# Altium project spectral_clock.PrjPcb
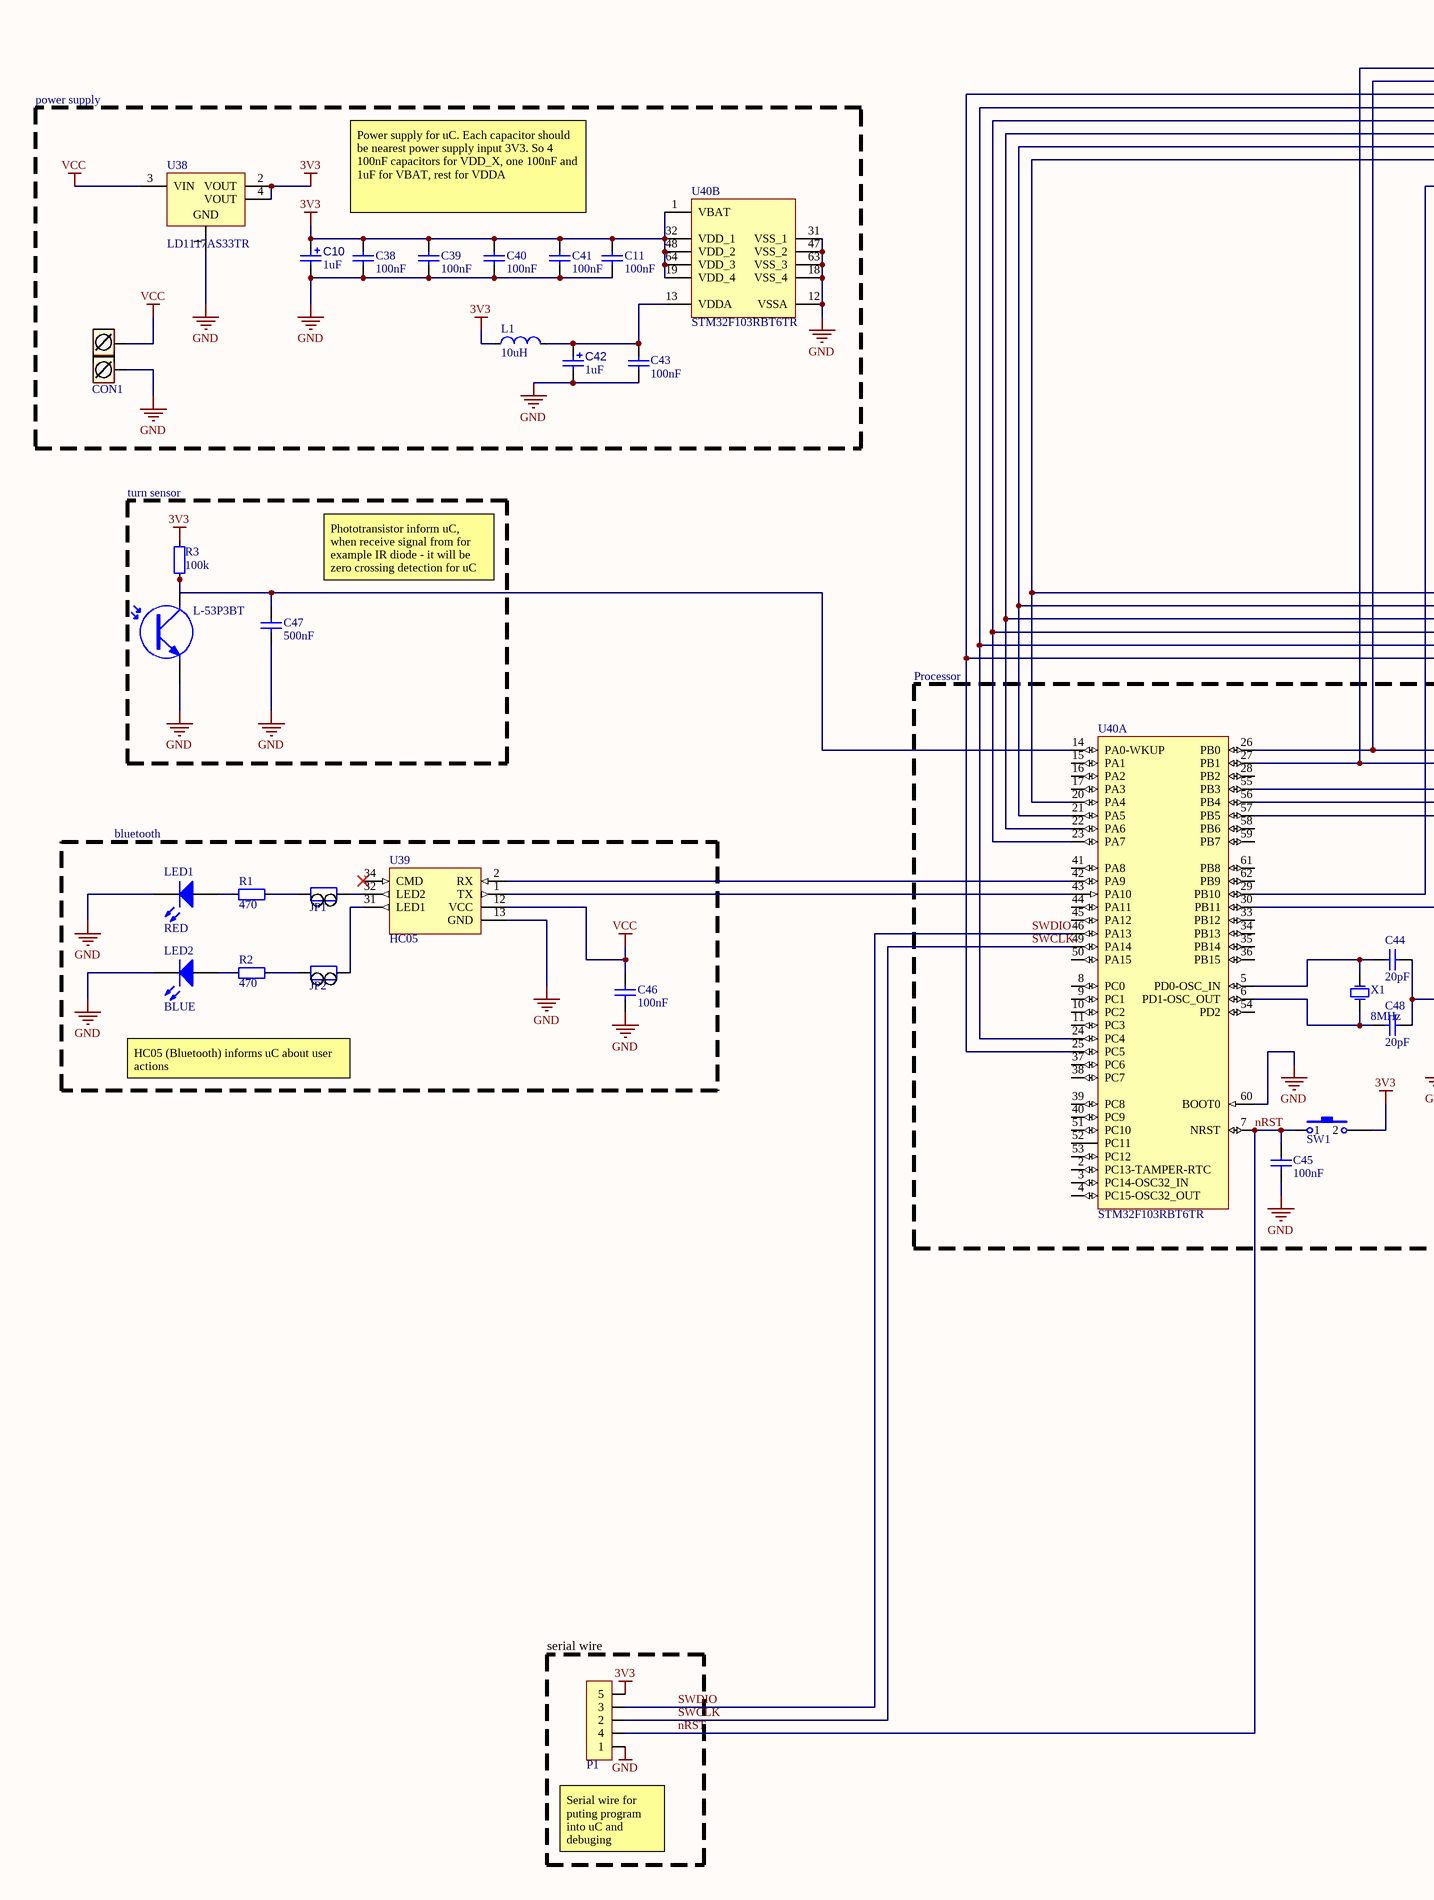
[diagram p0: spectral_clock.SchDoc, left]
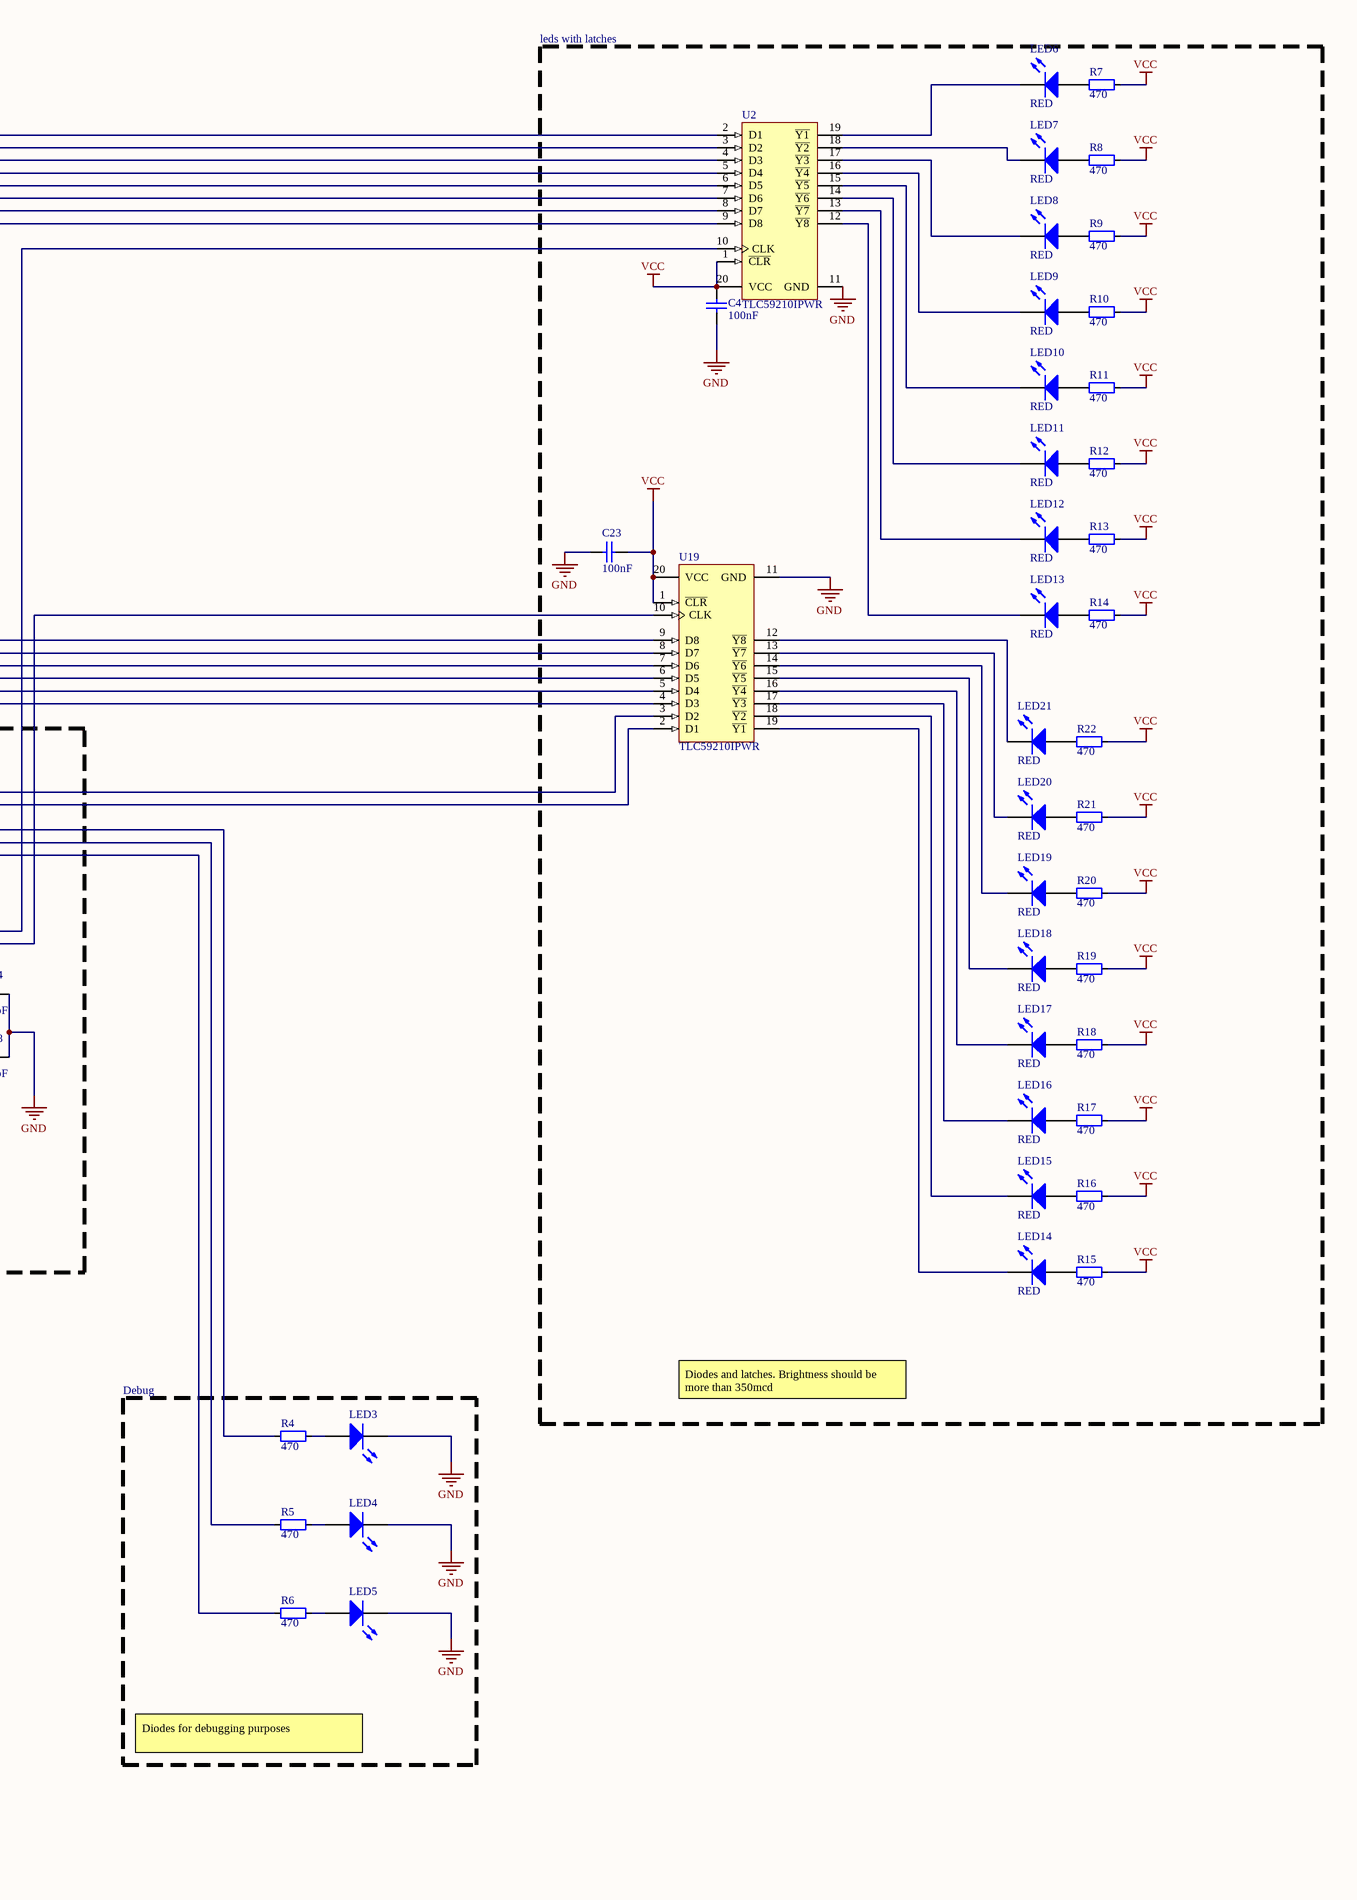
[diagram p1: spectral_clock.SchDoc, right]
1 sheet, 71 parts. Net scope: global (net labels, ports and power ports of the same name join across sheets).
Board file: spectral_clock.PcbDoc

## Sheet spectral_clock.SchDoc: Spectral clock schematic
size A2; DrawnBy: Jakub Wieczorek; DocumentNumber: 1; Revision: V2; SheetNumber: 1; SheetTotal: 1; url: https://github.com/jakubwieczorek/spectral_clock

### Parts
C4  value 100nF  [0603_CAP]  (hidden comment: Cap)
C10  1uF  [Con_SMD_4x5]
C11  value 100nF  [0603_CAP]  (hidden comment: Cap)
C23  value 100nF  [0603_CAP]  (hidden comment: Cap)
C38  value 100nF  [0603_CAP]  (hidden comment: Cap)
C39  value 100nF  [0603_CAP]  (hidden comment: Cap)
C40  value 100nF  [0603_CAP]  (hidden comment: Cap)
C41  value 100nF  [0603_CAP]  (hidden comment: Cap)
C42  1uF  [Con_SMD_4x5]
C43  value 100nF  [0603_CAP]  (hidden comment: Cap)
C44  value 20pF  [0603_CAP]  (hidden comment: Cap)
C45  value 100nF  [0603_CAP]  (hidden comment: Cap)
C46  value 100nF  [0603_CAP]  (hidden comment: Cap)
C47  value 500nF  [0603_CAP]  (hidden comment: Cap)
C48  value 20pF  [0603_CAP]  (hidden comment: Cap)
CON1  ARK2  [ARK2]  (value not drawn)
JP1  Jumper  [HDR1X2 - JP]  (value not drawn)
JP2  Jumper  [HDR1X2 - JP]  (value not drawn)
L1  10uH  [0603_IND]
L-53P3BT  Phototransistor  [LED_THT]  (value not drawn)
LED1  RED  [0603_led_red]
LED2  BLUE  [0603_led_blue]
LED3  (no value)  [0603_led_green]
LED4  RED  [0603_led_green]  (value not drawn)
LED5  RED  [0603_led_green]  (value not drawn)
LED6  RED  [0603_led_blue]
LED7  RED  [0603_led_blue]
LED8  RED  [0603_led_blue]
LED9  RED  [0603_led_blue]
LED10  RED  [0603_led_blue]
LED11  RED  [0603_led_blue]
LED12  RED  [0603_led_blue]
LED13  RED  [0603_led_blue]
LED14  RED  [0603_led_blue]
LED15  RED  [0603_led_blue]
LED16  RED  [0603_led_blue]
LED17  RED  [0603_led_blue]
LED18  RED  [0603_led_blue]
LED19  RED  [0603_led_blue]
LED20  RED  [0603_led_blue]
LED21  RED  [0603_led_blue]
P1  HDR1X5  [HDR1X5]  (value not drawn)
R1  470  [0603_RES]
R2  470  [0603_RES]
R3  100k  [0603_RES]
R4  470  [0603_RES]
R5  470  [0603_RES]
R6  470  [0603_RES]
R7  470  [0603_RES]
R8  470  [0603_RES]
R9  470  [0603_RES]
R10  470  [0603_RES]
R11  470  [0603_RES]
R12  470  [0603_RES]
R13  470  [0603_RES]
R14  470  [0603_RES]
R15  470  [0603_RES]
R16  470  [0603_RES]
R17  470  [0603_RES]
R18  470  [0603_RES]
R19  470  [0603_RES]
R20  470  [0603_RES]
R21  470  [0603_RES]
R22  470  [0603_RES]
SW1  Micro_Switch  [Tact 34N-F]  (value not drawn)
U2  TLC59210IPWR  [PW0020A_M]
U19  TLC59210IPWR  [PW0020A_M]
U38  LD1117AS33TR  [SOT-223_M]
U39  HC05  [HC05]
U40  STM32F103RBT6TR  [STM-LQFP64_V]  (parts A,B of 2)
X1  value 8MHz  [HC49/4H_SMX]

### Blocks framed on the sheet
leds with latches: C4 C23 LED6-LED21 R7-R22 U2 U19
power supply: C10 C11 C38-C43 CON1 L1 U38 U40
turn sensor: C47 L-53P3BT R3
Processor: C44 C45 C48 SW1 U40 X1
bluetooth: C46 JP1 JP2 LED1 LED2 R1 R2 U39
Debug: LED3-LED5 R4-R6
serial wire: P1

### Nets
3V3: C10.1 C11.2 C38.2 C39.2 C40.2 C41.2 L1.1 P1.5 R3.2 SW1.2 U38.2(VOUT) U38.4(VOUT) U40.1(VBAT) U40.19(VDD_4) U40.32(VDD_1) U40.48(VDD_2) U40.64(VDD_3)
GND: C4.2 C10.2 C11.1 C23.2 C38.1 C39.1 C40.1 C41.1 C42.2 C43.1 C44.2 C45.1 C46.2 C47.1 C48.2 CON1.1 L-53P3BT.1(E) LED1.2(K) LED2.2(K) LED3.2(K) LED4.2(K) LED5.2(K) P1.1 U2.11(GND) U19.11(GND) U38.1(GND) U39.13(GND) U40.12(VSSA) U40.18(VSS_4) U40.31(VSS_1) U40.47(VSS_2) U40.60(BOOT0) U40.63(VSS_3)
VCC: C4.1 C23.1 C46.1 CON1.2 R7.2 R8.2 R9.2 R10.2 R11.2 R12.2 R13.2 R14.2 R15.2 R16.2 R17.2 R18.2 R19.2 R20.2 R21.2 R22.2 U2.1(~{CLR}) U2.20(VCC) U19.1(~{CLR}) U19.20(VCC) U38.3(VIN) U39.12(VCC)
nRST: C45.2 P1.4 SW1.1 U40.7(NRST)
SWCLK: P1.2 U40.49(PA14)
SWDIO: P1.3 U40.46(PA13)
NetC42_1: C42.1 C43.2 L1.2 U40.13(VDDA)
NetC44_1: C44.1 U40.5(PD0-OSC_IN) X1.1(OSC1)
NetC47_2: C47.2 L-53P3BT.2(C) R3.1 U40.14(PA0-WKUP)
NetC48_1: C48.1 U40.6(PD1-OSC_OUT) X1.2(OSC2)
NetJP1_1: JP1.1 U39.32(LED2)
NetJP1_2: JP1.2 R1.1
NetJP2_1: JP2.1 U39.31(LED1)
NetJP2_2: JP2.2 R2.1
NetLED1_1: LED1.1(A) R1.2
NetLED2_1: LED2.1(A) R2.2
NetLED3_1: LED3.1(A) R4.2
NetLED4_1: LED4.1(A) R5.2
NetLED5_1: LED5.1(A) R6.2
NetLED6_1: LED6.1(A) R7.1
NetLED6_2: LED6.2(K) U2.19(~{Y1})
NetLED7_1: LED7.1(A) R8.1
NetLED7_2: LED7.2(K) U2.18(~{Y2})
NetLED8_1: LED8.1(A) R9.1
NetLED8_2: LED8.2(K) U2.17(~{Y3})
NetLED9_1: LED9.1(A) R10.1
NetLED9_2: LED9.2(K) U2.16(~{Y4})
NetLED10_1: LED10.1(A) R11.1
NetLED10_2: LED10.2(K) U2.15(~{Y5})
NetLED11_1: LED11.1(A) R12.1
NetLED11_2: LED11.2(K) U2.14(~{Y6})
NetLED12_1: LED12.1(A) R13.1
NetLED12_2: LED12.2(K) U2.13(~{Y7})
NetLED13_1: LED13.1(A) R14.1
NetLED13_2: LED13.2(K) U2.12(~{Y8})
NetLED14_1: LED14.1(A) R15.1
NetLED14_2: LED14.2(K) U19.19(~{Y1})
NetLED15_1: LED15.1(A) R16.1
NetLED15_2: LED15.2(K) U19.18(~{Y2})
NetLED16_1: LED16.1(A) R17.1
NetLED16_2: LED16.2(K) U19.17(~{Y3})
NetLED17_1: LED17.1(A) R18.1
NetLED17_2: LED17.2(K) U19.16(~{Y4})
NetLED18_1: LED18.1(A) R19.1
NetLED18_2: LED18.2(K) U19.15(~{Y5})
NetLED19_1: LED19.1(A) R20.1
NetLED19_2: LED19.2(K) U19.14(~{Y6})
NetLED20_1: LED20.1(A) R21.1
NetLED20_2: LED20.2(K) U19.13(~{Y7})
NetLED21_1: LED21.1(A) R22.1
NetLED21_2: LED21.2(K) U19.12(~{Y8})
NetR4_1: R4.1 U40.55(PB3)
NetR5_1: R5.1 U40.56(PB4)
NetR6_1: R6.1 U40.57(PB5)
NetU2_2: U2.2(D1) U19.2(D1) U40.27(PB1)
NetU2_3: U2.3(D2) U19.3(D2) U40.26(PB0)
NetU2_4: U2.4(D3) U19.4(D3) U40.25(PC5)
NetU2_5: U2.5(D4) U19.5(D4) U40.24(PC4)
NetU2_6: U2.6(D5) U19.6(D5) U40.23(PA7)
NetU2_7: U2.7(D6) U19.7(D6) U40.22(PA6)
NetU2_8: U2.8(D7) U19.8(D7) U40.21(PA5)
NetU2_9: U2.9(D8) U19.9(D8) U40.20(PA4)
NetU2_10: U2.10(CLK) U40.29(PB10)
NetU19_10: U19.10(CLK) U40.30(PB11)
NetU39_1: U39.1(TX) U40.43(PA10)
NetU39_2: U39.2(RX) U40.42(PA9)

Not connected (* = marked no-connect by the designer): U39 34(CMD)*; U40 2(PC13-TAMPER-RTC) 3(PC14-OSC32_IN) 4(PC15-OSC32_OUT) 8(PC0) 9(PC1) 10(PC2) 11(PC3) 15(PA1) 16(PA2) 17(PA3) 28(PB2) 33(PB12) 34(PB13) 35(PB14) 36(PB15) 37(PC6) 38(PC7) 39(PC8) 40(PC9) 41(PA8) 44(PA11) 45(PA12) 50(PA15) 51(PC10) 52(PC11) 53(PC12) 54(PD2) 58(PB6) 59(PB7) 61(PB8) 62(PB9)

### Notes on the sheet
- Power supply for uC. Each capacitor should be nearest power supply input 3V3. So 4 100nF capacitors for VDD_X, one 100nF and 1uF for VBAT, rest for VDDA
- Phototransistor inform uC, when receive signal from for example IR diode - it will be zero crossing detection for uC
- HC05 (Bluetooth) informs uC about user actions
- Diodes and latches. Brightness should be more than 350mcd
- Diodes for debugging purposes
- (near P1) Serial wire for puting program into uC and debuging
- Title
- Size:
- Date:
- Tabloid
- Number:
- Time:
- Revision:
- Sheet
- of
- File:

### Library data of the parts
C4 C11 C23 C38-C41 C43-C48 = Cap: Ceramic capacitor; Unit Price1: *; Unit Price2: *
C10 C42 = Cap_Pol: Polar capacitor; Value: 1uF
CON1 = ARK2: Złącze śrubowe 2 piny
JP1 JP2 = Jumper_2: Jumper, 2-Pin
L1 = Inductor: Code_IEC: 1005; Published: 8-Jun-2000; LatestRevisionDate: 29-May-2009; LatestRevisionNote: IPC-7351 Footprint Added.; PackageReference: 0402-A; Publisher: Altium Limited; PackageDescription: Chip Inductor; Code_JEITA: 0402; Value: 10uH
LED1 LED4-LED21 = LED: Light-emitting diode; COLOR: RED
LED2 LED3 = LED: Light-emitting diode; COLOR: RED
P1 = HDR1X5: Header, 5-Pin; LatestRevisionDate: 17-Jul-2002; LatestRevisionNote: Re-released for DXP Platform.; Publisher: Altium Limited
R1-R22 = RES: Resistior
  R1 R2 R4-R22: Value: 470
  R3: Value: 100k
SW1 = Micro_Switch: Switch; Published: 24-Mar-1999; LatestRevisionDate: 17-Jul-2002; LatestRevisionNote: Re-released for DXP Platform.; PackageReference: SPST-2; Publisher: Altium Limited
U2 U19 = CMP-0388-00401-2: 8-Bit DMOS Sink Driver with Latch, 3 to 5.5 V, -40 to 85 degC, 20-pin SOP (PW20), Green (RoHS & no Sb/Br); Manufacturer: Texas Instruments; Vin(Max)(V): 5.5; SubFamily: LED Driver; Vin(Min)(V): 3; ComponentLink1Description: Manufacturer URL; ComponentLink3URL: http://www.ti.com.cn/cn/lit/ml/mpds362/mpds362.pdf; ComponentLink3Description: Package Specification; ComponentLink2Description: Datasheet; PartNumber: TLC59210IPWR; ComponentLink2URL: http://www.ti.com/general/docs/lit/getliterature.tsp?genericPartNumber=TLC59210&fileType=pdf; Mounting Technology: Surface Mount; DatasheetVersion: SCLS711; PackageDescription: 20-Pin Plastic Small Outline, Body 6.5 x 4.4 mm, 0.65 mm Pitch; Eco-Plan: Green (RoHS & no Sb/Br); PackageReference: PW0020A; ComponentLink1URL: http://www.ti.com/; PackageVersion: 4040064-5/G; Code_JEDEC: MO-153
U38 = CMP-0244-00316-1: 1A, Low Drop Positive Voltage Regulator, 3.3V, 4-Pin SOT-223, Tape and Reel; ComponentLink1Description: Manufacturer URL; DatasheetVersion: 2/12/2011; PackageVersion: 2010; ComponentLink1URL: http://www.st.com; ComponentLink2Description: Datasheet; ComponentLink2URL: http://www.st.com/internet/com/TECHNICAL_RESOURCES/TECHNICAL_LITERATURE/DATASHEET/CD00002116.pdf; PackageDescription: 4-Pin SOT-223 Package, 6.5 x 3.5 mm Body, 2.3 mm Pitch, 7 mm Lead Span; PackageReference: SOT-223
U39 = HC05: Bluetooth to Serial Port Module
U40 = CMP-0237-00169-4: ARM Cortex-M3 32-bit MCU, 128 KB Flash, 20 KB Internal RAM, 51 I/Os, 64-pin LQFP, -40 to 85 degC, Tape and Reel; Operating Frequency(F) (Processor speed) (MHz): 72; Internal RAM Size (kB): 20; I/Os (High Current): 51; FLASH Size (Prog) (kB): 128; Supply Voltage(Vcc) min (V): 2; A/D Converter: 2x12-bit (16 Channel); ComponentLink3URL: http://www.st.com/st-web-ui/static/active/en/resource/technical/document/datasheet/DM00037051.pdf; ComponentLink2Description: Datasheet; PackageDescription: 64-Pin Low Profile Quad Flat Package, 10 x 10 mm Body, 0.5 mm Pitch; ComponentLink3Description: Package Specification; Mounting Technology: Surface Mount; ComponentLink1Description: Manufacturer URL; DatasheetVersion: Rev. 16; PackageReference: LQFP64; PartNumber: STM32F103RBT6TR; Core: ARM Cortex-M3; ComponentLink2URL: http://www.st.com/st-web-ui/static/active/en/resource/technical/document/datasheet/CD00161566.pdf; ComponentLink1URL: http://www.st.com/web/en/home.html; PackageVersion: Rev. 4, 06/2013; Packing: Tape and Reel
X1 = XTAL: Oscillator; Unit Price1: *; Unit Price2: *